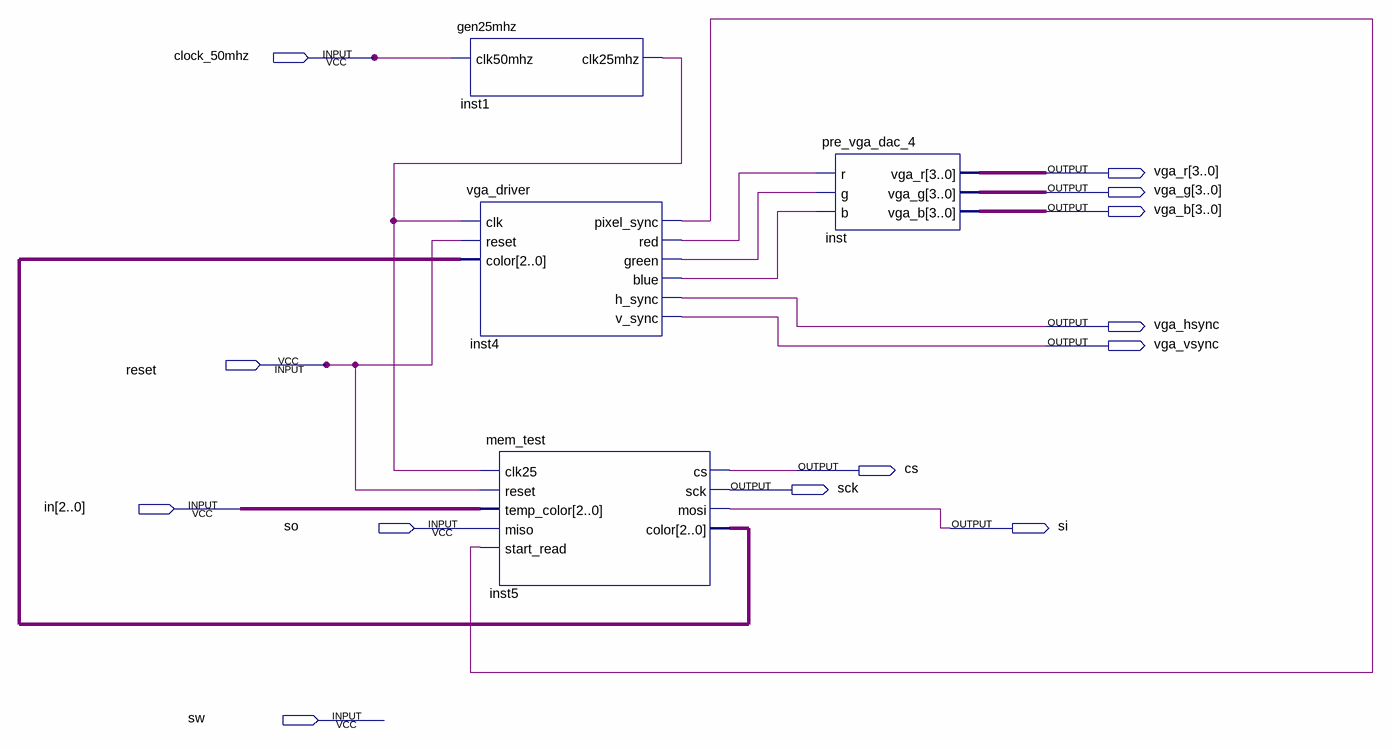
[diagram p0: schematic sheet]
// Quartus schematic top_de1.bdf as structural Verilog: 4 symbols, 13 pins
module top_de1 (
  input  clock_50mhz,
  input  reset,
  input  [2:0] in,
  input  so,
  input  sw,
  output [3:0] vga_r,
  output [3:0] vga_g,
  output [3:0] vga_b,
  output vga_hsync,
  output vga_vsync,
  output cs,
  output sck,
  output si
);

  wire inst1_clk25mhz, inst4_blue, inst4_green, inst4_pixel_sync, inst4_red;
  wire [2:0] inst5_color;

  gen25mhz inst1 (.clk50mhz(clock_50mhz), .clk25mhz(inst1_clk25mhz));
  vga_driver inst4 (
    .clk(inst1_clk25mhz), .reset(reset), .color(inst5_color), .pixel_sync(inst4_pixel_sync), .red(inst4_red),
    .green(inst4_green), .blue(inst4_blue), .h_sync(vga_hsync), .v_sync(vga_vsync));
  mem_test inst5 (
    .clk25(inst1_clk25mhz), .reset(reset), .temp_color(in), .miso(so), .start_read(inst4_pixel_sync),
    .cs(cs), .sck(sck), .mosi(si), .color(inst5_color));
  pre_vga_dac_4 inst (.r(inst4_red), .g(inst4_green), .b(inst4_blue), .vga_r(vga_r), .vga_g(vga_g), .vga_b(vga_b));
endmodule
